# EAGLE design n-channel-h-bridge-wide (EAGLE 7.2.0)
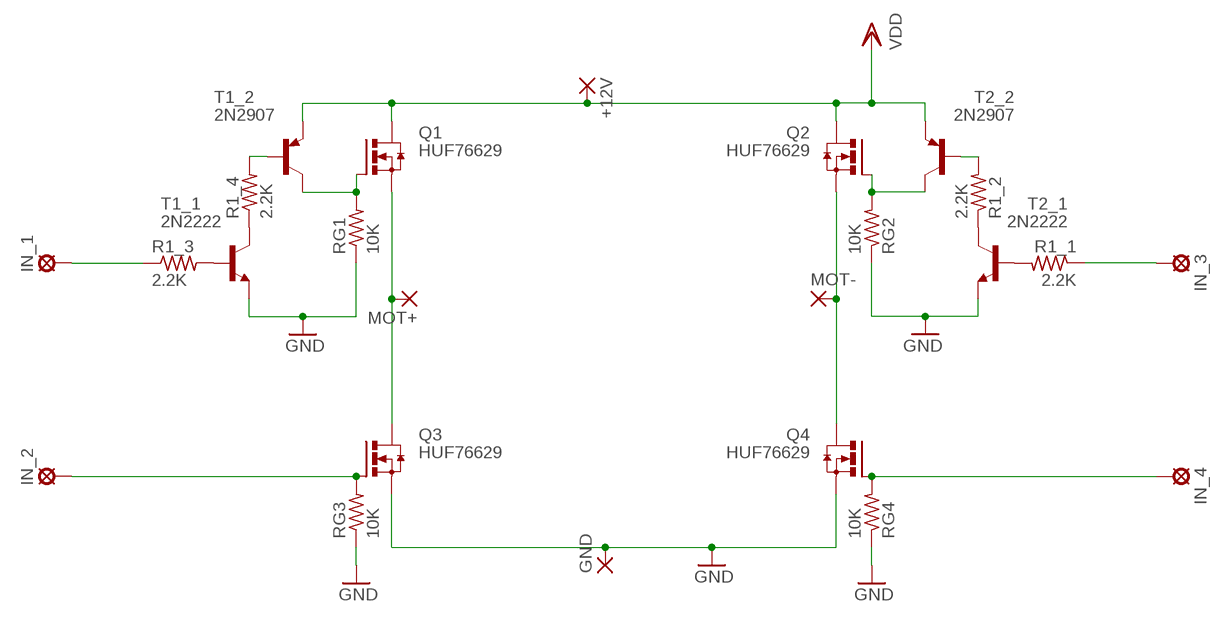
[diagram p0: schematic, sheet 1]

## Parts
+12V  WIREPAD4,16O1,6  [4,16O1,6]
GND  WIREPAD4,16O1,6  [4,16O1,6]
IN_1  LSP11  [LSP11]
IN_2  LSP11  [LSP11]
IN_3  LSP11  [LSP11]
IN_4  LSP11  [LSP11]
MOT+  WIREPAD4,16O1,6  [4,16O1,6]
MOT-  WIREPAD4,16O1,6  [4,16O1,6]
Q1  HUF76629  HUF76629D3ST_F085D-PAK_TO252  [D-PAK_TO252]
Q2  HUF76629  HUF76629D3ST_F085D-PAK_TO252  [D-PAK_TO252]
Q3  HUF76629  HUF76629D3ST_F085D-PAK_TO252  [D-PAK_TO252]
Q4  HUF76629  HUF76629D3ST_F085D-PAK_TO252  [D-PAK_TO252]
R1_1  2.2K  R-US_R0805  [R0805]
R1_2  2.2K  R-US_R0805  [R0805]
R1_3  2.2K  R-US_R0805  [R0805]
R1_4  2.2K  R-US_R0805  [R0805]
RG1  10K  R-US_R0805  [R0805]
RG2  10K  R-US_R0805  [R0805]
RG3  10K  R-US_R0805  [R0805]
RG4  10K  R-US_R0805  [R0805]
T1_1  2N2222  [TO92-EBC-OVAL]
T1_2  2N2907  [TO92-EBC-OVAL]
T2_1  2N2222  [TO92-EBC-OVAL]
T2_2  2N2907  [TO92-EBC-OVAL]

## Nets
B: IN_2.MP Q3.1(G) RG3.2
D: IN_4.MP Q4.1(G) RG4.2
GND: GND.1(P) Q3.3(S) Q4.3(S) RG1.1 RG2.1 RG3.1 RG4.1 T1_1.E T2_1.E
N$1: R1_1.2 T2_1.B
N$2: R1_2.1 T2_1.C
N$3: R1_2.2 T2_2.B
N$4: Q2.1(G) RG2.2 T2_2.C
N$5: MOT-.1(P) Q2.3(S) Q4.4(D)
N$6: IN_1.MP R1_3.1
N$7: IN_3.MP R1_1.1
N$10: R1_3.2 T1_1.B
N$11: R1_4.1 T1_1.C
N$14: R1_4.2 T1_2.B
N$15: Q1.1(G) RG1.2 T1_2.C
N$18: MOT+.1(P) Q1.3(S) Q3.4(D)
VDD: +12V.1(P) Q1.4(D) Q2.4(D) T1_2.E T2_2.E

## Library data of the parts
+12V GND MOT+ MOT- = wirepad:WIREPAD: Wire PAD connect wire on PCB
IN_1-IN_4 = solpad:LSP11: SOLDER PAD drill 1.1 mm
Q1-Q4 = nervus:HUF76629D3ST_F085: N-Channel Logic Level UltraFET Power MOSFET 100 V, 20 A, 52 mΩ Datasheet <https://www.fairchildsemi.com/datasheets/HU/HUF76629D3S.pdf>
R1_1-R1_4 RG1-RG4 = resistor:R-US_: RESISTOR, American symbol
T1_1 T2_1 = adafruit:2N2222: NPN TRANSISTOR Big oval pads
T1_2 T2_2 = adafruit:2N2907*: PNP Transistor Big Oval pads

## Net classes
0 default: width 0.254 mm, clearance 0.254 mm
1 HiCurrent: width 1.905 mm, clearance 0.508 mm

## Board
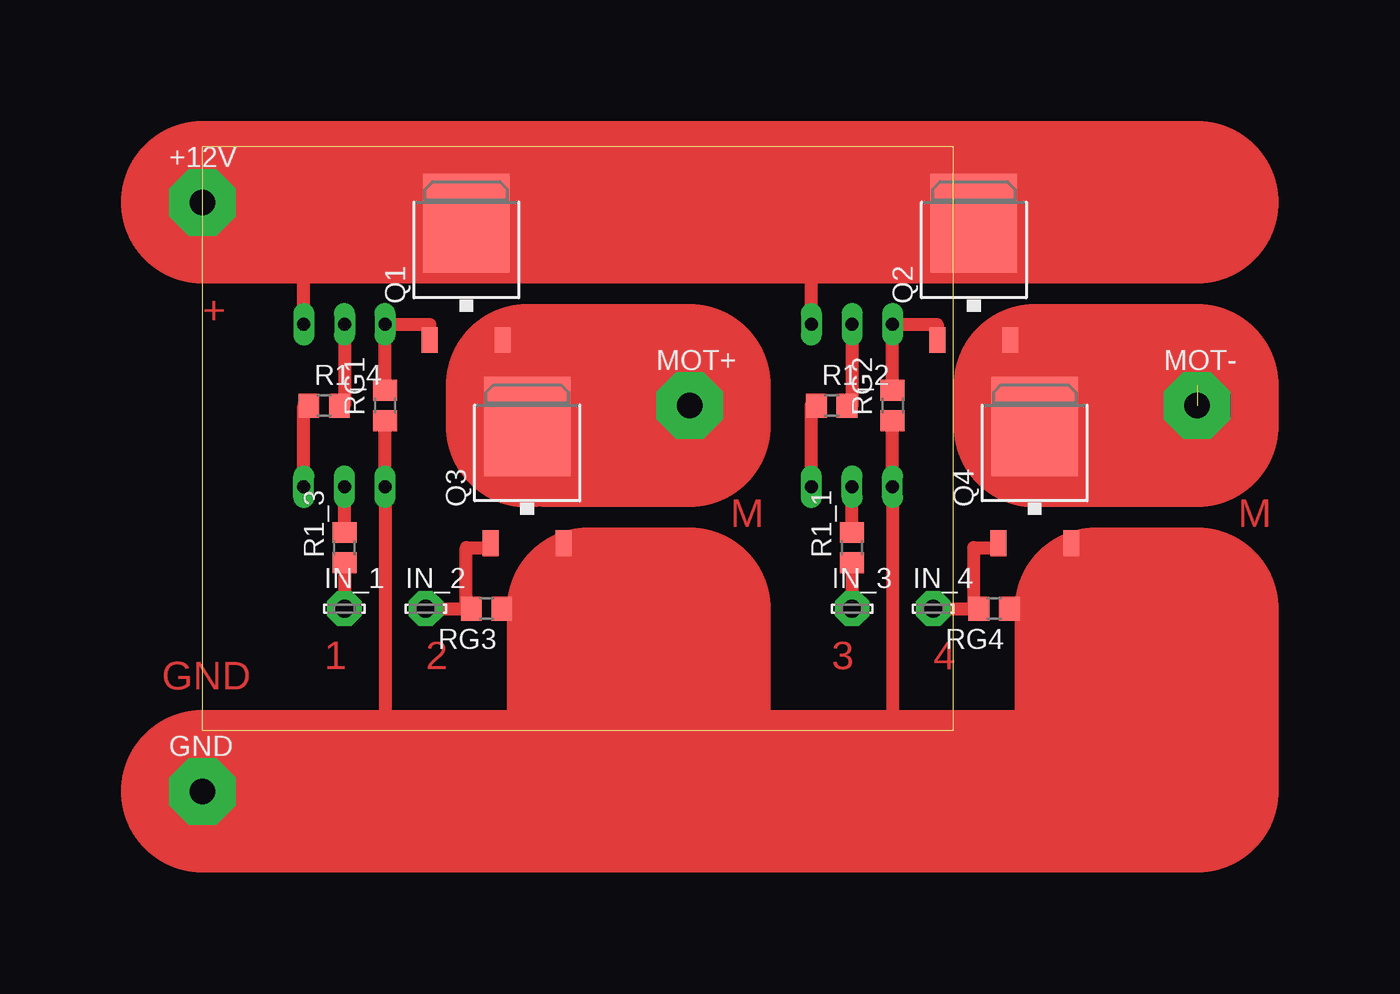
[diagram p1: board, top side]
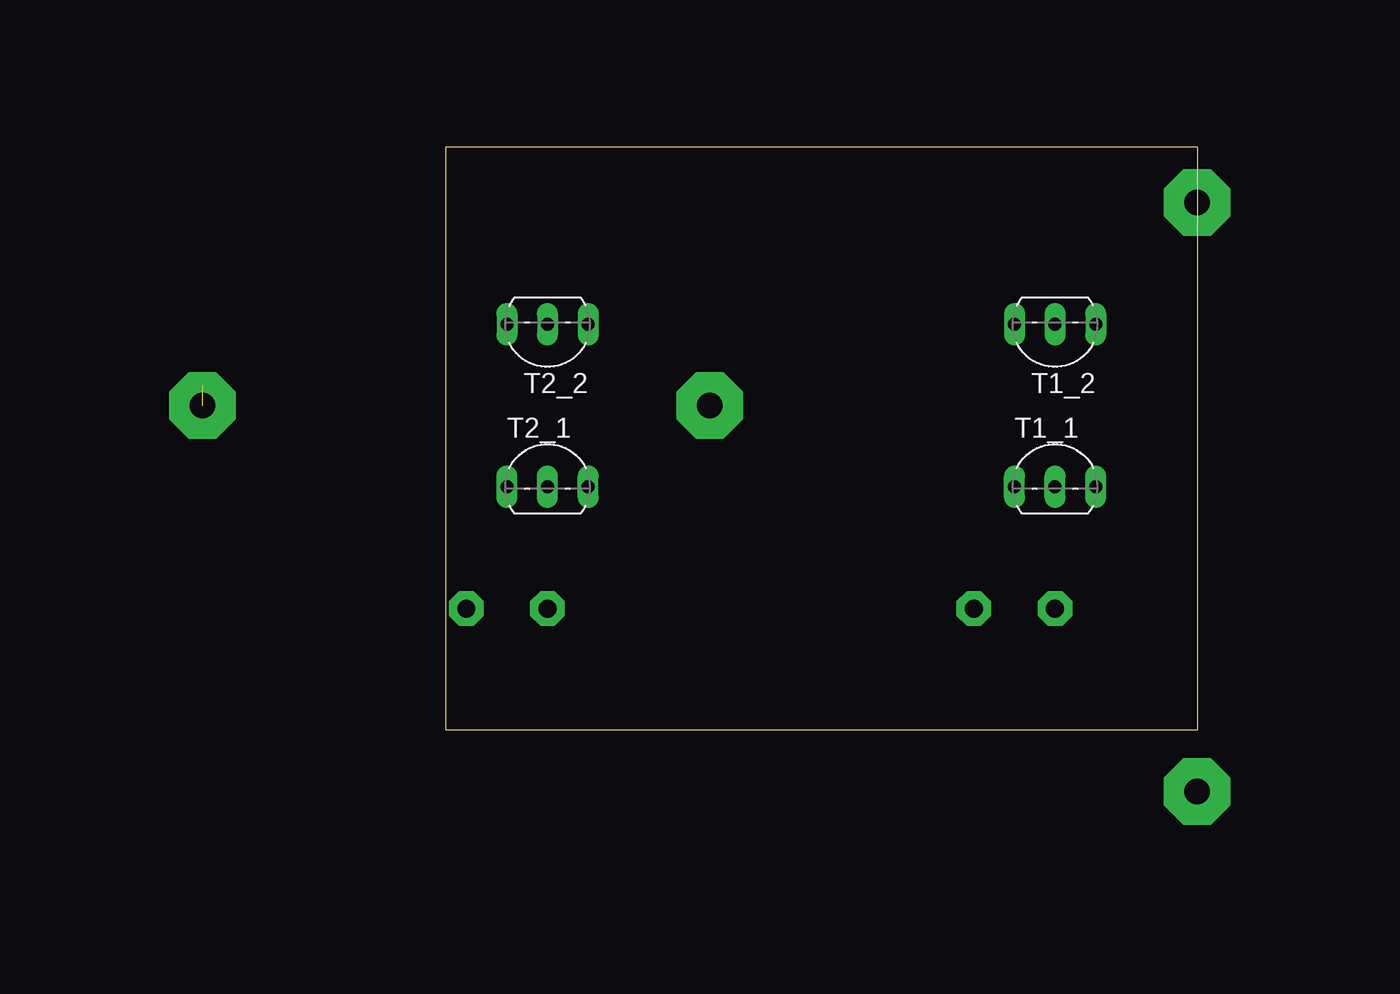
[diagram p2: board, bottom side, seen from below]

Size 46.97 x 36.5 mm. Coordinates in mm from the lower left corner, seen from the top.
Outline: 0,0 46.97,0 46.97,36.5 0,36.5 0,0
Copper layers (1*16): Top 0.035mm / dielectric 1.5mm / Bottom 0.035mm
Design rules "default": minimum track width 10mil, minimum drill 24mil, track to track 8mil, track to pad 8mil, pad to pad 8mil, via to via 8mil, smd to smd 8mil, copper to edge 40mil, drill to drill 8mil, minimum pad ring 10mil, minimum via ring 8mil, stop-mask expansion 4mil, vias tented up to drill 0mil, thermal gap 10mil

### Footprints (pad centres in the part's own frame; a part is rotated, then mirrored left to right if it is on the bottom)
4,16O1,6 = drill 1.6 pad 4.166 octagon: 1 0,0
LSP11 = drill 1.118 pad 2.159 octagon: MP 0,0
D-PAK_TO252 = smd 1 x 1.6: 1 -2.28,-4.8; 3 2.28,-4.8 | smd 5.4 x 6.2: 4 0,2.5
R0805 = smd 1.3 x 1.5: 1 -0.95,0; 2 0.95,0
TO92-EBC-OVAL = drill 0.813 long: B 0,-1.27; C 2.54,-1.27; E -2.54,-1.27

### Placement (x,y rotation side)
+12V  0,33.02 0 top
GND  0,-3.81 0 top  (outside the outline)
IN_1  8.89,7.62 0 top
IN_2  13.97,7.62 0 top
IN_3  40.64,7.62 0 top
IN_4  45.72,7.62 0 top
MOT+  30.48,20.32 0 top
MOT-  62.23,20.32 0 top  (outside the outline)
Q1  16.51,29.21 0 top
Q2  48.26,29.21 0 top
Q3  20.32,16.51 0 top
Q4  52.07,16.51 0 top
R1_1  40.64,11.43 90 top
R1_2  39.37,20.32 0 top
R1_3  8.89,11.43 90 top
R1_4  7.62,20.32 0 top
RG1  11.43,20.32 90 top
RG2  43.18,20.32 90 top
RG3  17.78,7.62 180 top
RG4  49.53,7.62 180 top
T1_1  8.89,16.51 0 bottom
T1_2  8.89,24.13 180 bottom
T2_1  40.64,16.51 0 bottom
T2_2  40.64,24.13 180 bottom

### Tracks (layer width: path | path; a pad name or v marks a point on that pad's centre or on a via)
B
  Top 0.813: IN_2.MP RG3.2 16.51,7.62 16.51,11.43 18.04,11.43 Q3.1
D
  Top 0.813: IN_4.MP RG4.2 48.26,7.62 48.26,11.43 49.79,11.43 Q4.1
GND
  Top 0.813: RG1.1 T1_1.E 11.43,-3.81 | RG2.1 T2_1.E 43.18,-3.81 | Q4.3 55.88,11.71 55.88,7.62 | Q3.3 22.6,7.62 RG3.1 20.32,7.62 20.32,5.08 24.13,5.08 24.13,-1.27 | 24.13,-3.81 24.13,-2.54 | RG4.1 57.15,7.62
  Top 10.16: GND.1 11.43,-3.81 24.13,-3.81 43.18,-3.81 55.88,-3.81 | 55.88,-3.81 55.88,7.62 57.15,7.62 62.23,7.62 62.23,-3.81 55.88,-3.81 | 24.13,-1.27 24.13,7.62 30.48,7.62 30.48,-1.27 24.13,-1.27 | 24.13,-1.27 24.13,-2.54
N$1
  Top 0.813: R1_1.2 T2_1.B
N$2
  Top 0.813: 38.1,20 R1_2.1 38.1,20.32 T2_1.C
N$3
  Top 0.813: 40.64,20.64 R1_2.2 40.64,20.32 40.64,20.64 | T2_2.B 40.64,20.64
N$4
  Top 0.813: Q2.1 45.98,25.4 T2_2.C RG2.2
N$5  (1 unrouted)
  Top 0.813: Q2.3 52.07,24.41 Q4.4
  Top 10.16: Q4.4 52.07,19.05 | 52.07,19.05 52.07,20.32 | 52.07,20.32 55.88,20.32 | 55.88,20.32 55.88,19.05 | 55.88,21.59 55.88,20.32 | 55.88,21.59 52.07,21.59 52.07,20.32 | 52.07,19.05 55.88,19.05 | 55.88,19.05 62.23,19.05 62.23,21.59 55.88,21.59
N$6
  Top 0.813: R1_3.1 IN_1.MP
N$7
  Top 0.813: R1_1.1 IN_3.MP
N$10
  Top 0.813: R1_3.2 T1_1.B
N$11
  Top 0.813: T1_1.C 6.35,20.32 R1_4.1
N$14
  Top 0.813: T1_2.B 8.89,20.32 R1_4.2
N$15
  Top 0.813: RG1.2 T1_2.C 14.23,25.4 Q1.1
N$18
  Top 0.813: Q1.3 21.59,24.41 21.59,21.59 | 30.48,16.51 30.48,19.05 22.86,19.05 22.86,20.32 MOT+.1
  Top 10.16: Q3.4 20.32,21.59 21.59,21.59 30.48,21.59 MOT+.1 30.48,19.05 24.13,19.05 | 24.13,20.32 24.13,19.05 | 21.59,19.05 22.86,19.05 24.13,19.05
VDD
  Top 0.406: Q1.4 16.51,30.48
  Top 0.813: 16.47,31.75 Q1.4 16.51,33.02 12.7,33.02 | T2_2.E 38.1,33.02 48.26,33.02 Q2.4 | T1_2.E 6.35,33.02
  Top 10.16: +12V.1 6.35,33.02 12.7,33.02 38.1,33.02 62.23,33.02

### Text on the board
Top: + | M+ | M | M | 1 | 2 | 3 | 4 | GND